# Altium schematic sheet Hall_Sensor.SchDoc: PREN HallSensor
size A3; DrawnBy: Flavio Kreiliger; Organization: HSLU T&A; Address1: Abteilung Elektrotechnik; Address2: Technikumsstrasse 21; Address3: CH-6048 Horw; SheetNumber: 1; SheetTotal: 1; Projektname: PREN HallSensor; DocumentName: PREN HallSensor; ProjectName: PREN HallSensor
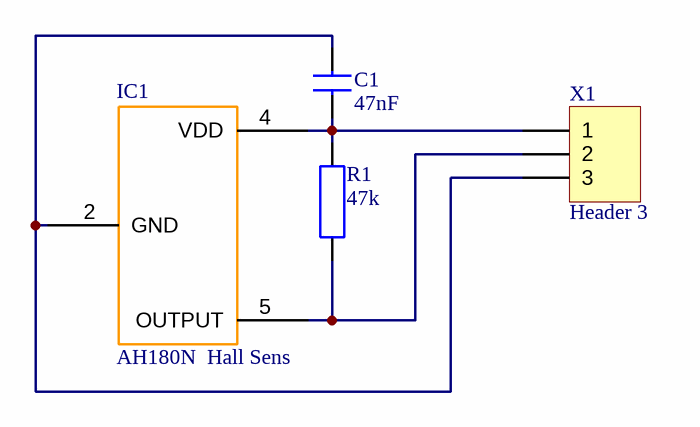
[diagram p0: Hall_Sensor.SchDoc]

## Parts
C1  47nF  [0805]
IC1  AH180N  Hall Sens  [AH180N SOT553]
R1  47k  [0805]
X1  Header 3  [Edge Connector 3 Pin]

## Nets
NetC1_1: C1.1 IC1.2(GND) X1.3
NetC1_2: C1.2 IC1.4(VDD) R1.2 X1.1
NetIC1_5: IC1.5(OUTPUT) R1.1 X1.2

Not connected (* = marked no-connect by the designer): IC1 1(NC) 3(NC)

## Notes on the sheet
- Project:
- Drawn by:
- Size:
- Sheet
- A3
- Rev.:
- of
- Date:
- File:

## Library data of the parts
C1 = C?: Normaler Kondensator
IC1 = AH180N: Hall Sensor AH180N
R1 = R?: Normaler Widerstand
X1 = Header 3: Header, 3-Pin; LatestRevisionDate: 17-Jul-2002; LatestRevisionNote: Re-released for DXP Platform.; Publisher: Altium Limited